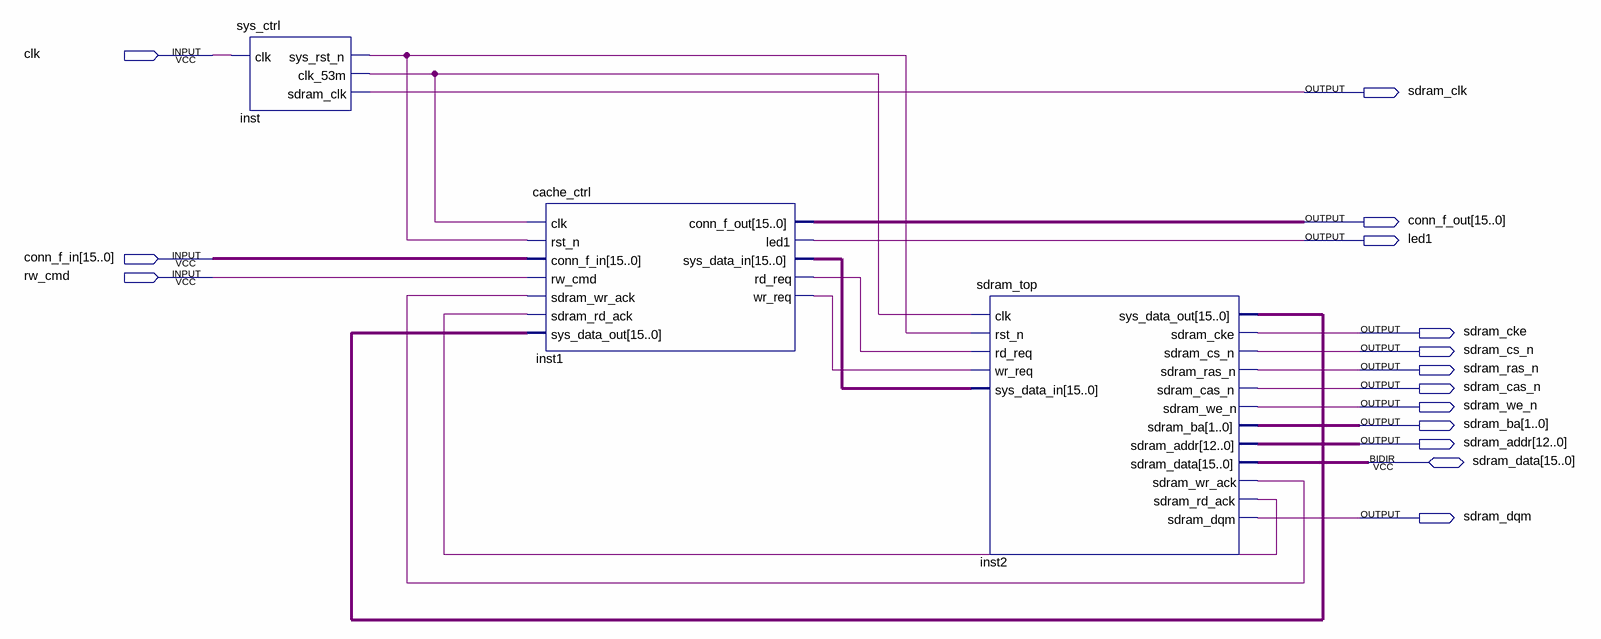
[diagram p0: schematic sheet]
// Quartus schematic system_module.bdf as structural Verilog: 3 symbols, 15 pins
module system_module (
  input  clk,
  input  [15:0] conn_f_in,
  input  rw_cmd,
  inout  [15:0] sdram_data,
  output sdram_clk,
  output [15:0] conn_f_out,
  output led1,
  output sdram_cke,
  output sdram_cs_n,
  output sdram_ras_n,
  output sdram_cas_n,
  output sdram_we_n,
  output [1:0] sdram_ba,
  output [12:0] sdram_addr,
  output sdram_dqm
);

  wire inst1_rd_req, inst1_wr_req, inst2_sdram_rd_ack, inst2_sdram_wr_ack, inst_clk_53m, inst_sys_rst_n;
  wire [15:0] inst1_sys_data_in, inst2_sys_data_out;

  sys_ctrl inst (.clk(clk), .sys_rst_n(inst_sys_rst_n), .clk_53m(inst_clk_53m), .sdram_clk(sdram_clk));
  cache_ctrl inst1 (
    .clk(inst_clk_53m), .rst_n(inst_sys_rst_n), .conn_f_in(conn_f_in), .rw_cmd(rw_cmd),
    .sdram_wr_ack(inst2_sdram_wr_ack), .sdram_rd_ack(inst2_sdram_rd_ack), .sys_data_out(inst2_sys_data_out),
    .conn_f_out(conn_f_out), .led1(led1), .sys_data_in(inst1_sys_data_in), .rd_req(inst1_rd_req),
    .wr_req(inst1_wr_req));
  sdram_top inst2 (
    .clk(inst_clk_53m), .rst_n(inst_sys_rst_n), .rd_req(inst1_rd_req), .wr_req(inst1_wr_req),
    .sys_data_in(inst1_sys_data_in), .sys_data_out(inst2_sys_data_out), .sdram_cke(sdram_cke),
    .sdram_cs_n(sdram_cs_n), .sdram_ras_n(sdram_ras_n), .sdram_cas_n(sdram_cas_n), .sdram_we_n(sdram_we_n),
    .sdram_ba(sdram_ba), .sdram_addr(sdram_addr), .sdram_wr_ack(inst2_sdram_wr_ack),
    .sdram_rd_ack(inst2_sdram_rd_ack), .sdram_dqm(sdram_dqm), .sdram_data(sdram_data));
endmodule
